# Altium schematic sheet k26_baseboard_telemetry_extconn.SchDoc: k26 Baseboard Telemetry/Ext. Connectors
size A3; DrawnBy: Ch. Vogt; Organization: PBL; DocumentNumber: 1; Revision: r5; SheetNumber: 6
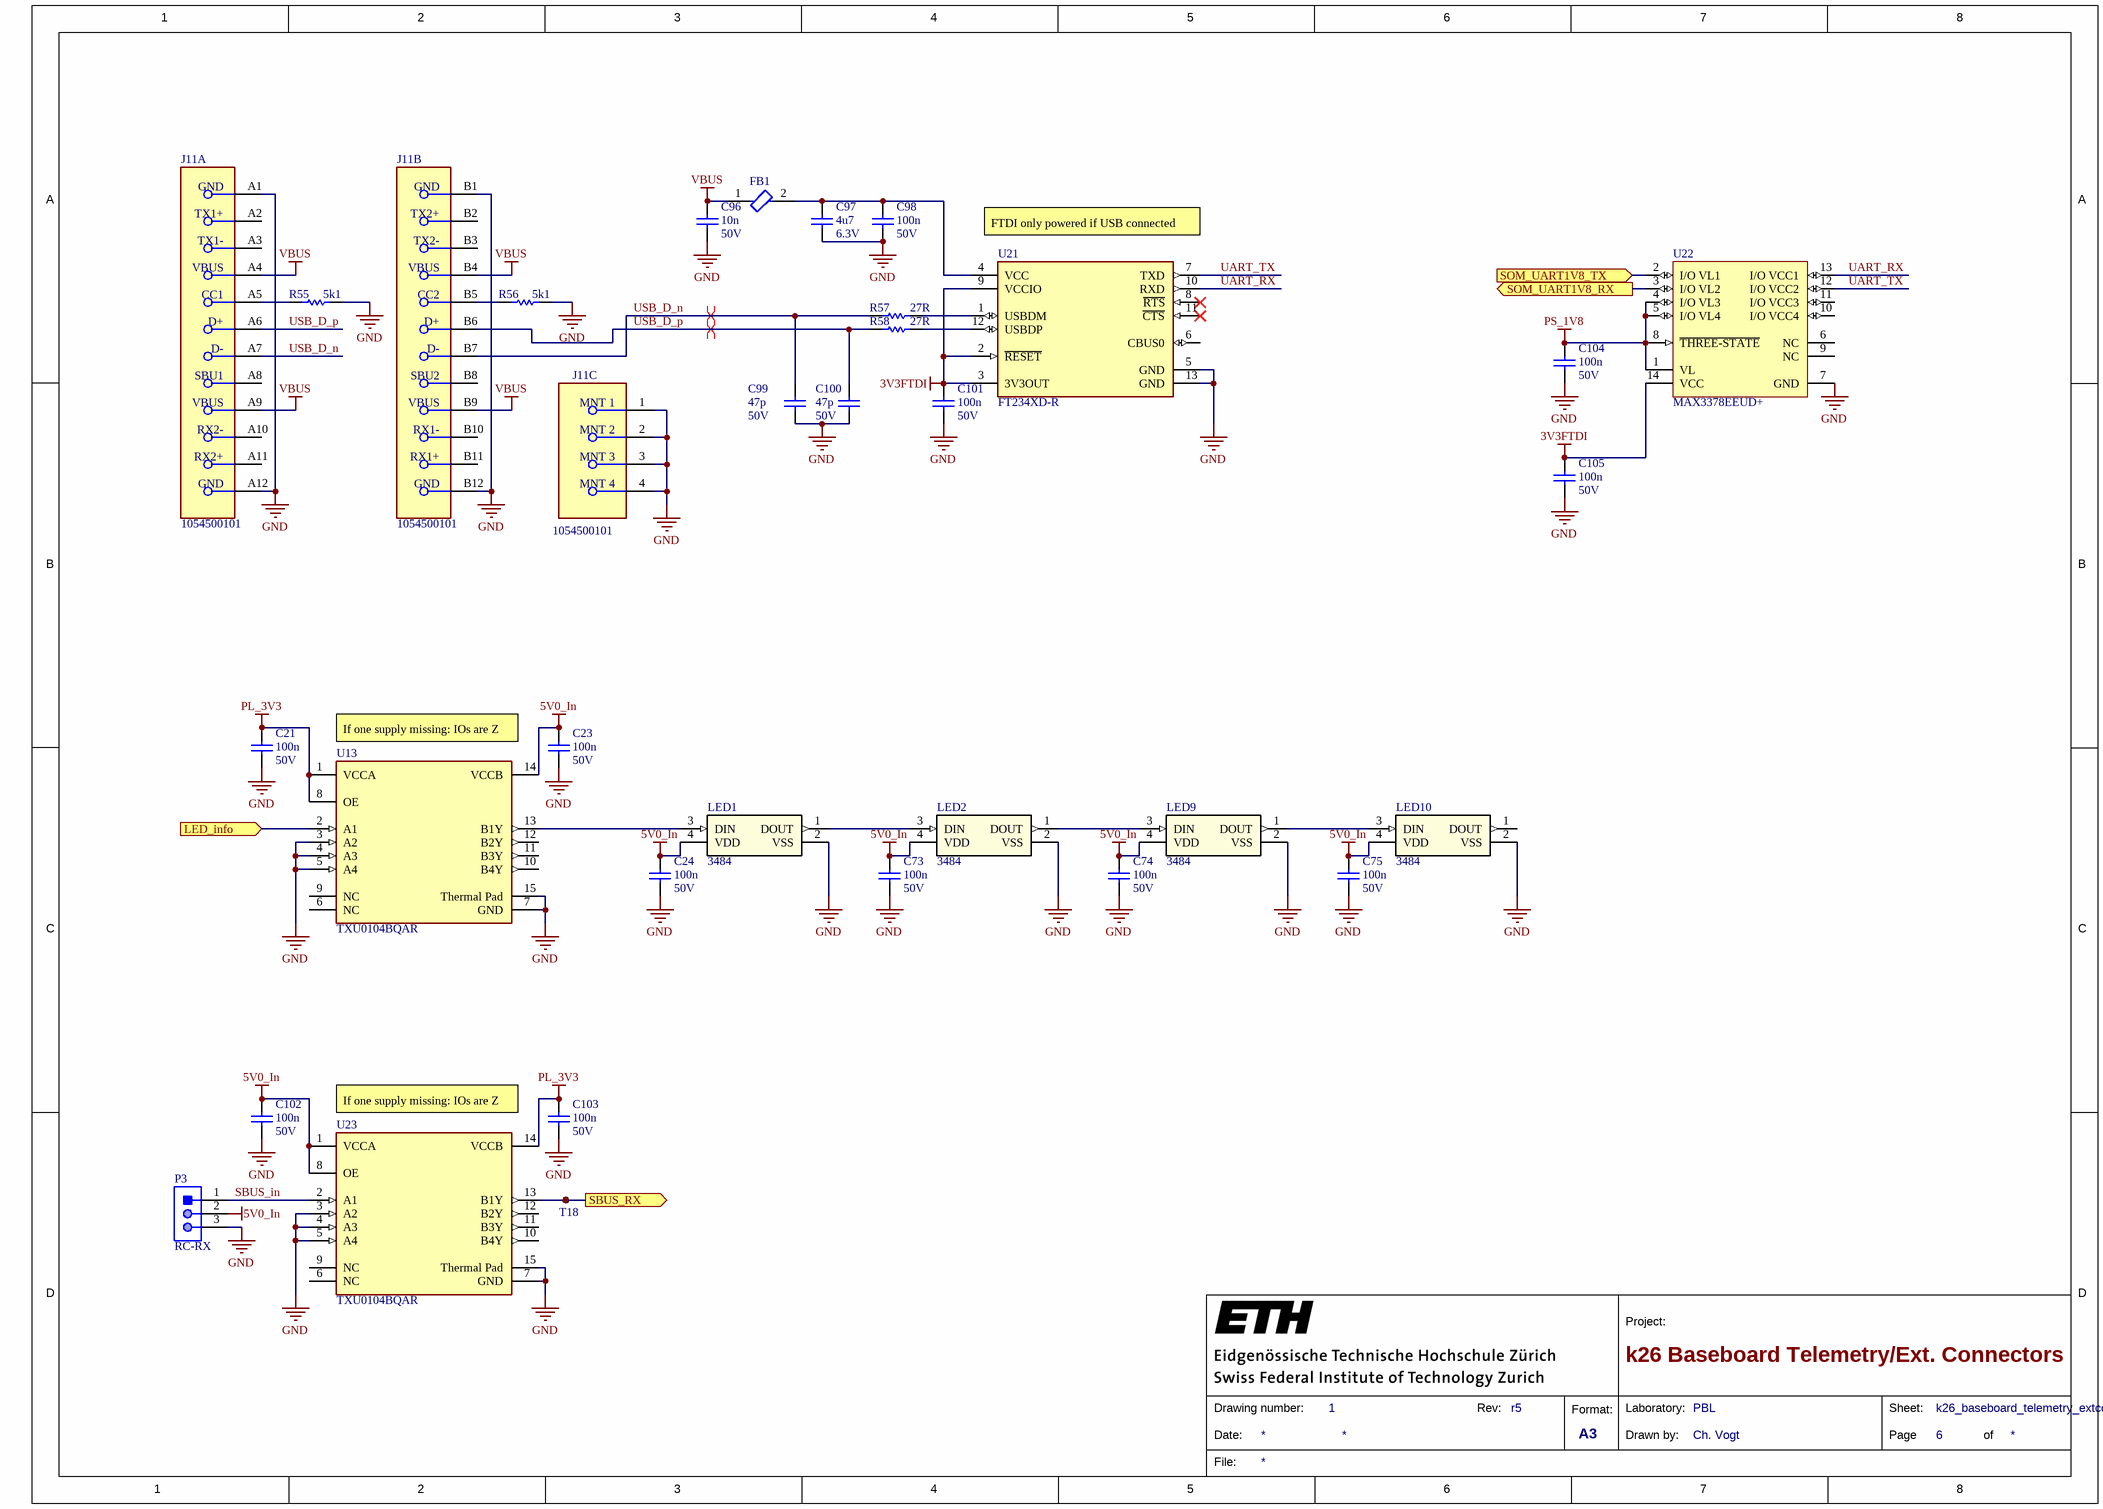
[diagram p0: k26_baseboard_telemetry_extconn.SchDoc]

## Parts
C21  100n  Rated DC Voltage (URdc): 50V  [CAPC0402]
C23  100n  Rated DC Voltage (URdc): 50V  [CAPC0402]
C24  100n  Rated DC Voltage (URdc): 50V  [CAPC0402]
C73  100n  Rated DC Voltage (URdc): 50V  [CAPC0402]
C74  100n  Rated DC Voltage (URdc): 50V  [CAPC0402]
C75  100n  Rated DC Voltage (URdc): 50V  [CAPC0402]
C96  10n  Rated DC Voltage (URdc): 50V  [CAPC0402]
C97  4u7  Rated DC Voltage (URdc): 6.3V  [CAPC0402]
C98  100n  Rated DC Voltage (URdc): 50V  [CAPC0402]
C99  47p  Rated DC Voltage (URdc): 50V  [CAPC0402]
C100  47p  Rated DC Voltage (URdc): 50V  [CAPC0402]
C101  100n  Rated DC Voltage (URdc): 50V  [CAPC0402]
C102  100n  Rated DC Voltage (URdc): 50V  [CAPC0402]
C103  100n  Rated DC Voltage (URdc): 50V  [CAPC0402]
C104  100n  Rated DC Voltage (URdc): 50V  [CAPC0402]
C105  100n  Rated DC Voltage (URdc): 50V  [CAPC0402]
FB1  BLM18PG600SN1D  [FP-BLM18-0_15-t0_8-MFG]  (value not drawn)
J11  1054500101  [FP-1054500101-MFG]  (parts A,B,C of 3)
LED1  3484  [3484_ADA-L]
LED2  3484  [3484_ADA-L]
LED9  3484  [3484_ADA-L]
LED10  3484  [3484_ADA-L]
P3  RC-RX  [MOLX-22-28-4033_V]
R55  5k1  [RES0402]
R56  5k1  [RES0402]
R57  27R  [RES0402]
R58  27R  [RES0402]
T18  CMP-01283-1  [Pad-1mm]  (value not drawn)  (no BOM)
U13  TXU0104BQAR  [FP-BQA0014A-MFG]
U21  FT234XD-R  [FP-DFN-12-IPC_B]
U22  MAX3378EEUD+  [MAXM-U14+1_V]
U23  TXU0104BQAR  [FP-BQA0014A-MFG]

## Ports
LED_info (in), SBUS_RX (out), SOM_UART1V8_RX (out), SOM_UART1V8_TX (in)

## Nets
3V3FTDI: C101.2 C105.2 U21.2(~{RESET}) U21.3(3V3OUT) U21.9(VCCIO) U22.14(VCC)
5V0_In: C23.2 C24.2 C73.2 C74.2 C75.2 C102.2 LED1.4(VDD) LED2.4(VDD) LED9.4(VDD) LED10.4(VDD) P3.2 U13.14(VCCB) U23.1(VCCA) U23.8(OE)
GND: C21.1 C23.1 C24.1 C73.1 C74.1 C75.1 C96.1 C97.1 C98.1 C99.1 C100.1 C101.1 C102.1 C103.1 C104.1 C105.1 J11.1(MNT_1) J11.2(MNT_2) J11.3(MNT_3) J11.4(MNT_4) J11.A1(GND) J11.A12(GND) J11.B1(GND) J11.B12(GND) LED1.2(VSS) LED2.2(VSS) LED9.2(VSS) LED10.2(VSS) P3.3 R55.1 R56.1 U13.3(A2) U13.4(A3) U13.5(A4) U13.7(GND) U13.15(Thermal_Pad) U21.5(GND) U21.13(GND) U22.7(GND) U23.3(A2) U23.4(A3) U23.5(A4) U23.7(GND) U23.15(Thermal_Pad)
PL_3V3: C21.2 C103.2 U13.1(VCCA) U13.8(OE) U23.14(VCCB)
PS_1V8: C104.2 U22.1(VL) U22.4(I/O_VL3) U22.5(I/O_VL4) U22.8(~{THREE-STATE})
VBUS: C96.2 FB1.1 J11.A4(VBUS) J11.A9(VBUS) J11.B4(VBUS) J11.B9(VBUS)
LED_info: U13.2(A1) ; port LED_info
SBUS_in: P3.1 U23.2(A1)
SBUS_RX: T18.1 U23.13(B1Y) ; port SBUS_RX
SOM_UART1V8_RX: U22.3(I/O_VL2) ; port SOM_UART1V8_RX
SOM_UART1V8_TX: U22.2(I/O_VL1) ; port SOM_UART1V8_TX
UART_RX: U21.10(RXD) U22.13(I/O_VCC1)
UART_TX: U21.7(TXD) U22.12(I/O_VCC2)
USB_D_n: C99.2 J11.A7(D-) J11.B7(D-) R57.1
USB_D_p: C100.2 J11.A6(D+) J11.B6(D+) R58.1
NetC97_2: C97.2 C98.2 FB1.2 U21.4(VCC)
NetJ11_A5: J11.A5(CC1) R55.2
NetJ11_B5: J11.B5(CC2) R56.2
NetLED1_1: LED1.1(DOUT) LED2.3(DIN)
NetLED1_3: LED1.3(DIN) U13.13(B1Y)
NetLED2_1: LED2.1(DOUT) LED9.3(DIN)
NetLED9_1: LED9.1(DOUT) LED10.3(DIN)
NetR57_2: R57.2 U21.1(USBDM)
NetR58_2: R58.2 U21.12(USBDP)

Not connected (* = marked no-connect by the designer): J11 A2(TX1+) A3(TX1-) A8(SBU1) A10(RX2-) A11(RX2+) B2(TX2+) B3(TX2-) B8(SBU2) B10(RX1-) B11(RX1+); LED10 1(DOUT); U13 6(NC) 9(NC) 10(B4Y) 11(B3Y) 12(B2Y); U21 6(CBUS0) 8(~{RTS})* 11(~{CTS})*; U22 6(NC) 9(NC) 10(I/O_VCC4) 11(I/O_VCC3); U23 6(NC) 9(NC) 10(B4Y) 11(B3Y) 12(B2Y)

## Layout directives
differential pair: USB_D_n, USB_D_p

## Notes on the sheet
- (near U21) FTDI only powered if USB connected
- If one supply missing: IOs are Z
- 1
- 2
- 3
- 4
- 5
- 6
- 7
- 8
- A
- B
- C
- D
- Project:
- Date:
- Drawing number:
- Rev:
- Format:
- A3
- Drawn by:
- Laboratory:
- Page
- Sheet:
- of
- File:

## Library data of the parts
C21 C23 C24 C73-C75 C98 C101-C105 = cap0402: Ceramic Capacitor, Multilayer, Ceramic, 50V, 10% +Tol, 10% -Tol, X5R, 15% TC, 0.1uF, Surface Mount, 0402; Manufacturer: Yageo; Manufacturer Part Number: CC0402KRX5R9BB104; Capacitance: 100nF; Multilayer: Yes; Supplier 1: Farnell; Supplier Part Number 1: 3366442; RoHS: Yes; Category: Ceramic Capacitors; Stock 1: 180000; Pricing 1: 10000=0.00890, 50000=0.00870 (CHF); Mount: Surface Mount; Number of Pins: 2; Dielectric Material: Ceramic; Package Shape: Rectangular; Size Code: 0402; Terminal Finish: Nickel; Min Operating Temperature: -55°C; Max Operating Temperature: 85°C; JESD-609 Code: e3; Capacitor Type: Ceramic; Negative Tolerance: 10%; Temperature Characteristics Code: X5R; Termination: Wraparound; Positive Tolerance: 10%; Package Style: SMTMeter; Packaging: Tape and Reel; Length: 1mm; Width: 0.5mm; Height: 0.5mm; Reach SVHC Compliant: Yes; RoHS Compliant: Yes; ComponentLink1URL: https://datasheet.ciiva.com:443/pdfs/VipMasterIC/IC/YAGO/YAGO-S-A0006851646/YAGO-S-A0006851646-1.pdf?src-supplier=IHS+Markit; ComponentLink1Description: https://datasheet.ciiva.com:443/pdfs/VipMasterIC/IC/YAGO/YAGO-S-A0006851646/YAGO-S-A0006851646-1.pdf?src-supplier=IHS+Markit; ComponentLink2URL: http://www.yageo.com/documents/recent/UPY-GPHC_X5R_4V-to-50V_25.pdf?src-supplier=Digi-Key; ComponentLink2Description: http://www.yageo.com/documents/recent/UPY-GPHC_X5R_4V-to-50V_25.pdf?src-supplier=Digi-Key; ComponentLink3URL: http://www.yageo.com/documents/recent/UPY-GPHC_X5R_4V-to-50V_23.pdf?src-supplier=Digi-Key; ComponentLink3Description: http://www.yageo.com/documents/recent/UPY-GPHC_X5R_4V-to-50V_23.pdf?src-supplier=Digi-Key
C96 = cap0402: Ceramic Capacitor, Multilayer, Ceramic, 50V, 10% +Tol, 10% -Tol, X7R, 15% TC, 0.01uF, Surface Mount, 0402; Manufacturer: Samsung; Manufacturer Part Number: CL05B103KB5NNNC; Value: 10nF; Multilayer: Yes; Supplier: Rs; Supplier Part Number: 7661558; RoHS: Yes; Category: Ceramic Capacitors; Stock: 350000; Pricing: 10000=0.00500, 30000=0.00400, 50000=0.00400, 100000=0.00400, 250000=0.00400 (CHF); Mounting Technology: Surface Mount; Pins: 2; Dielectric Material: Ceramic; Case/Package: 0402; Package Shape: Rectangular; Terminal Finish: Nickel; Min Operating Temperature: -55°C; Max Operating Temperature: 125°C; Capacitor Type: Ceramic; Tolerance  (fill in as +-): 10%; Tolerance (fill in as +-): 10%; Temperature Characteristics Code: X7R; Package Style: SMTMeter; Packaging: Tape and Reel; Termination: Wraparound; JESD-609 Code: e3; Length: 1mm; Width: 0.5mm; Height: 0.55mm; RoHS Compliant: Yes; Reach SVHC Compliant: Yes; ComponentLink1URL: https://datasheet.ciiva.com:443/pdfs/VipMasterIC/IC/SEMS/SEMS-S-A0008525088/SEMS-S-A0008525146-1.pdf?src-supplier=IHS+Markit; ComponentLink1Description: https://datasheet.ciiva.com:443/pdfs/VipMasterIC/IC/SEMS/SEMS-S-A0008525088/SEMS-S-A0008525146-1.pdf?src-supplier=IHS+Markit; ComponentLink2URL: https://datasheet.ciiva.com/15195/getdatasheetpartid-359682-15195636.pdf?src-supplier=Verical; ComponentLink2Description: https://datasheet.ciiva.com/15195/getdatasheetpartid-359682-15195636.pdf?src-supplier=Verical; ComponentLink3URL: https://datasheet.ciiva.com/29198/458761-da-01-en-vs-kondensator-0402-29198432.pdf?src-supplier=Conrad; ComponentLink3Description: https://datasheet.ciiva.com/29198/458761-da-01-en-vs-kondensator-0402-29198432.pdf?src-supplier=Conrad; ComponentLink4URL: https://datasheet.ciiva.com/26309/mlcc-catalogdownload2013-eng-26309005.pdf?src-supplier=Distrelec; ComponentLink4Description: https://datasheet.ciiva.com/26309/mlcc-catalogdownload2013-eng-26309005.pdf?src-supplier=Distrelec
C97 = cap0402: Ceramic Capacitor, Multilayer, Ceramic, 6.3V, 20% +Tol, 20% -Tol, X5R, 15% TC, 4.7uF, Surface Mount, 0402; Manufacturer: Murata; Manufacturer Part Number: GRM155R60J475ME47D; Multilayer: Yes; Supplier: Rs; Supplier Part Number: 8145230P; RoHS: Yes; Category: Ceramic Capacitors; Stock: 151550; Pricing: 250=0.08100, 500=0.07500, 1000=0.07000, 2500=0.06200 (CHF); Mounting Technology: Surface Mount; Pins: 2; Dielectric Material: Ceramic; Package Shape: Rectangular; Case/Package: 0402; Terminal Finish: Nickel; Min Operating Temperature: -55°C; Max Operating Temperature: 85°C; Value: 4.7uF; Capacitor Type: Ceramic; Tolerance  (fill in as +-): 20%; Packaging: Tape and Reel; Tolerance (fill in as +-): 20%; Termination: Wraparound; JESD-609 Code: e3; Temperature Characteristics Code: X5R; Package Style: SMTMeter; Length: 1mm; Width: 0.5mm; Height: 0.5mm; Reach SVHC Compliant: Yes; RoHS Compliant: Yes; ComponentLink1URL: https://datasheet.ciiva.com:443/pdfs/VipMasterIC/IC/MURE/MURE-S-A0008911298/MURE-S-A0008911388-1.pdf?src-supplier=IHS+Markit; ComponentLink1Description: https://datasheet.ciiva.com:443/pdfs/VipMasterIC/IC/MURE/MURE-S-A0008911298/MURE-S-A0008911388-1.pdf?src-supplier=IHS+Markit; ComponentLink2URL: https://datasheet.ciiva.com/6270/product-6270483.pdf?src-supplier=Digi-Key; ComponentLink2Description: https://datasheet.ciiva.com/6270/product-6270483.pdf?src-supplier=Digi-Key; ComponentLink3URL: https://datasheet.ciiva.com/46418/1769893-46418044.pdf?src-supplier=Element14; ComponentLink3Description: https://datasheet.ciiva.com/46418/1769893-46418044.pdf?src-supplier=Element14; ComponentLink4URL: https://datasheet.ciiva.com/46418/1769893-46418045.pdf?src-supplier=Element14; ComponentLink4Description: https://datasheet.ciiva.com/46418/1769893-46418045.pdf?src-supplier=Element14; ComponentLink5URL: https://datasheet.ciiva.com/6268/partnumbering-e-01-6268378.pdf?src-supplier=Digi-Key; ComponentLink5Description: https://datasheet.ciiva.com/6268/partnumbering-e-01-6268378.pdf?src-supplier=Digi-Key; ComponentLink6URL: https://datasheet.ciiva.com/6268/partnumbering-e-01-6268382.pdf?src-supplier=Digi-Key; ComponentLink6Description: https://datasheet.ciiva.com/6268/partnumbering-e-01-6268382.pdf?src-supplier=Digi-Key
C99 C100 = cap0402: Ceramic Capacitor, Multilayer, Ceramic, 50V, 5% +Tol, 5% -Tol, C0G, -/+30ppm/Cel TC, 0.000047uF, Surface Mount, 0402; Manufacturer: Murata; Manufacturer Part Number: GRM1555C1H470JZ01D; Value: 47pF; Multilayer: Yes; Supplier: Farnell; Supplier Part Number: 1118143; RoHS: Yes; Category: Ceramic Capacitors; Pricing: 1=41.51000, 3=38.54000 (GBP); Mounting Technology: Surface Mount; Pins: 2; Dielectric Material: Ceramic; Case/Package: 0402; Terminal Finish: Nickel; Package Shape: Rectangular; Min Operating Temperature: -55°C; Max Operating Temperature: 125°C; JESD-609 Code: e3; Capacitor Type: Ceramic; Tolerance  (fill in as +-): 5%; Package Style: SMTMeter; Packaging: Tape and Reel; Tolerance (fill in as +-): 5%; Temperature Characteristics Code: C0G; Termination: Wraparound; Length: 1mm; Width: 0.5mm; Height: 0.5mm; RoHS Compliant: Yes; Reach SVHC Compliant: Yes
  C99: ComponentLink1URL: https://datasheet.ciiva.com:443/pdfs/VipMasterIC/IC/MURE/MURE-S-A0002988077/MURE-S-A0002987565-1.pdf?src-supplier=IHS+Markit; ComponentLink1Description: https://datasheet.ciiva.com:443/pdfs/VipMasterIC/IC/MURE/MURE-S-A0002988077/MURE-S-A0002987565-1.pdf?src-supplier=IHS+Markit; ComponentLink2URL: https://datasheet.ciiva.com/129/product-129747.pdf?src-supplier=Digi-Key; ComponentLink2Description: https://datasheet.ciiva.com/129/product-129747.pdf?src-supplier=Digi-Key; ComponentLink3URL: https://datasheet.ciiva.com/18100/getdatasheetpartid-32342-18100875.pdf?src-supplier=Verical; ComponentLink3Description: https://datasheet.ciiva.com/18100/getdatasheetpartid-32342-18100875.pdf?src-supplier=Verical; ComponentLink4URL: https://datasheet.ciiva.com/11787/0900766b807a1cab-11787251.pdf?src-supplier=Rs; ComponentLink4Description: https://datasheet.ciiva.com/11787/0900766b807a1cab-11787251.pdf?src-supplier=Rs; ComponentLink5URL: https://datasheet.ciiva.com/129/partnumbering-e-01-129748.pdf?src-supplier=Digi-Key; ComponentLink5Description: https://datasheet.ciiva.com/129/partnumbering-e-01-129748.pdf?src-supplier=Digi-Key; ComponentLink6URL: https://datasheet.ciiva.com/129/partnumbering-e-01-129749.pdf?src-supplier=Digi-Key; ComponentLink6Description: https://datasheet.ciiva.com/129/partnumbering-e-01-129749.pdf?src-supplier=Digi-Key; ComponentLink7URL: https://datasheet.ciiva.com/16396/l0005e-16396809.pdf?src-supplier=Future+Electronics; ComponentLink7Description: https://datasheet.ciiva.com/16396/l0005e-16396809.pdf?src-supplier=Future+Electronics
  C100: ComponentLink1URL: https://datasheet.ciiva.com:443/pdfs/VipMasterIC/IC/YAGO/YAGO-S-A0006851646/YAGO-S-A0006851646-1.pdf?src-supplier=IHS+Markit; ComponentLink1Description: https://datasheet.ciiva.com:443/pdfs/VipMasterIC/IC/YAGO/YAGO-S-A0006851646/YAGO-S-A0006851646-1.pdf?src-supplier=IHS+Markit; ComponentLink2URL: http://www.yageo.com/documents/recent/UPY-GPHC_X5R_4V-to-50V_25.pdf?src-supplier=Digi-Key; ComponentLink2Description: http://www.yageo.com/documents/recent/UPY-GPHC_X5R_4V-to-50V_25.pdf?src-supplier=Digi-Key; ComponentLink3URL: http://www.yageo.com/documents/recent/UPY-GPHC_X5R_4V-to-50V_23.pdf?src-supplier=Digi-Key; ComponentLink3Description: http://www.yageo.com/documents/recent/UPY-GPHC_X5R_4V-to-50V_23.pdf?src-supplier=Digi-Key; ComponentLink4URL: https://datasheet.ciiva.com:443/pdfs/VipMasterIC/IC/MURE/MURE-S-A0002988077/MURE-S-A0002987565-1.pdf?src-supplier=IHS+Markit; ComponentLink4Description: https://datasheet.ciiva.com:443/pdfs/VipMasterIC/IC/MURE/MURE-S-A0002988077/MURE-S-A0002987565-1.pdf?src-supplier=IHS+Markit; ComponentLink5URL: https://datasheet.ciiva.com/129/product-129747.pdf?src-supplier=Digi-Key; ComponentLink5Description: https://datasheet.ciiva.com/129/product-129747.pdf?src-supplier=Digi-Key; ComponentLink6URL: https://datasheet.ciiva.com/18100/getdatasheetpartid-32342-18100875.pdf?src-supplier=Verical; ComponentLink6Description: https://datasheet.ciiva.com/18100/getdatasheetpartid-32342-18100875.pdf?src-supplier=Verical; ComponentLink7URL: https://datasheet.ciiva.com/11787/0900766b807a1cab-11787251.pdf?src-supplier=Rs; ComponentLink7Description: https://datasheet.ciiva.com/11787/0900766b807a1cab-11787251.pdf?src-supplier=Rs; ComponentLink8URL: https://datasheet.ciiva.com/129/partnumbering-e-01-129748.pdf?src-supplier=Digi-Key; ComponentLink8Description: https://datasheet.ciiva.com/129/partnumbering-e-01-129748.pdf?src-supplier=Digi-Key; ComponentLink9URL: https://datasheet.ciiva.com/129/partnumbering-e-01-129749.pdf?src-supplier=Digi-Key; ComponentLink9Description: https://datasheet.ciiva.com/129/partnumbering-e-01-129749.pdf?src-supplier=Digi-Key; ComponentLink10URL: https://datasheet.ciiva.com/16396/l0005e-16396809.pdf?src-supplier=Future+Electronics; ComponentLink10Description: https://datasheet.ciiva.com/16396/l0005e-16396809.pdf?src-supplier=Future+Electronics
FB1 = CMP-0686-00575-3: Chip Ferrite Bead, 0603, 60Ω @ 100MHz, 0.1Ω, , 1A; Manufacturer: Murata; ESR (Equivalent Series Resistance): 60R; Number of Lines: 1; Material: Steel; Tolerance: 25%; Shielding: Unshielded; Current Rating: 500mA; Resistance: 100mR; Package Quantity: 1; Termination: SMD/SMT; Lead Free: Lead Free; Max Operating Temperature: 125°C; Number of Circuits: 1; Length: 1.6mm; Min Operating Temperature: -55°C; Case Code (Metric): 1608; Max DC Current: 500mA; REACH SVHC: No SVHC; Frequency: 100MHz; Number of Pins: 2; RoHS Compliant: Yes; Height: 0.8mm; Depth: 0.8mm; Width: 0.8mm; Test Frequency: 100MHz; Case/Package: 0603; Impedance: 60R; Max Current Rating: 500mA; Packaging: Tape and Reel; DC Resistance (DCR): 100mR; Case Code (Imperial): 0603; Core Material: Ferrite; Manufacturer Part Number: BLM18PG600SN1D
J11 = CONN RCP USB3.1: CONN RCP USB3.1 TYPEC 24P SMD RA; Manufacturer: Molex; Manufacturer Part Number: 105450-0101; Number Of Contacts: 24; Voltage Rating: 30V; Shielding: true; Is Female: yes; Current Rating: 0.25/1.25/5A; Pitch: 0.5mm; Conn Orientation: Right Angle; Package: 0; Height: 3.44mm; Footprint Url: https://www.molex.com/pdm_docs/sd/1054500101_sd.pdf; Device Class L1: Connectors; Category: Conn; Device Class L2: USB Connectors; Digikey Description: CONN RCP USB3.1 TYPEC 24P SMD RA; Contact Material: Gold,Nickel; Mouser Description: USB Shielded I/O Receptacle; Type C; Right Angle; Surface Mount; Gold over Nickel; ComponentLink2Description: Datasheet; Lead Free: Yes; Automotive: No; Temperature Range High: +85°C; RoHS: TRUE; Octopart: https://octopart.com/105450-0101-molex-68082325; ComponentLink2URL: https://www.molex.com/webdocs/datasheets/pdf/en-us/1054500101_IO_CONNECTORS.pdf; Temperature: -30°C to +85°C; Usb Standard: USB 3.1; Temperature Range Low: -30°C; Device Class L3: unset; Manufacturer Part Number: 1054500101
LED1 LED2 LED9 LED10 = 3484: No Description Available; Mfr_Name: Adafruit Industries; Type: DEV; Copyright: Copyright (C) 2024 Ultra Librarian. All rights reserved.; Manufacturer_Part_Number: 3484; RefDes: RefDes
P3 = CMP-1676-00001-5: Male Header, Pitch 2.54 mm, 1 x 3 Position, Height 8.38 mm, Tail Length 3.18 mm, RoHS, Bulk; Manufacturer: Molex; Rows: 1; Voltage Rating: 250 V; Current Rating: 4 A; Min Operating Temperature: 0 degC; Lead Pitch: 0.1 inch; Packaging: Bulk; Contact Finish: Gold; RoHSCompliant: true; Contact Material: Brass; PackageReference: 22-28-4033; REACH SVHC: Unknown; PackageDescription: Male Header, Pitch 2.54 mm, 1 x 3 Position, Height 8.38 mm, Tail Length 3.18 mm; ComponentLink2URL: http://www.molex.com/pdm_docs/sd/022284033_sd.pdf; Height: 8.38 mm; Mounting Technology: Through Hole; ComponentLink1Description: Manufacturer URL; Length: 7.62 mm; Mount: Through Hole; DatasheetVersion: Rev. G, 01/2012; Max Operating Temperature: 75 degC; ComponentLink2Description: Datasheet; Colour: Black; Pins: 3; Contact Plating: Gold; Package Quantity: 1; ComponentLink1URL: http://www.molex.com/; Manufacturer Part Number: 22-28-4033
R55 R56 = res0402: Fixed Resistor, Metal Glaze/thick Film, 0.0625W, 5100ohm, 50V, 1% +/-Tol, 100ppm/Cel, Surface Mount, 0402; Manufacturer: Yageo; Manufacturer Part Number: RC0402FR-075K1L; Power: 62.5mW; Value: 5.1kR; Temperature Coefficient: 100ppm/°C; Rated Temperature: 70°C; Additional Feature: LASER TRIMMABLE; Package Height: 0.35mm; Package Length: 1mm; Package Width: 0.5mm; Supplier: Rs; Supplier Part Number: 1987836; RoHS: Yes; Category: Chip SMD Resistors; Stock: 16400; Pricing: 100=0.01100, 1000=0.01100, 2500=0.00900, 5000=0.00800, 10000=0.00800 (CHF); Mounting Technology: Surface Mount; Pins: 2; Case/Package: 0402; Package Shape: Rectangular; Terminal Finish: Nickel; Min Operating Temperature: -55°C; Max Operating Temperature: 155°C; Tolerance: 1%; Resistor Type: FIXED RESISTOR; Construction: Chip; Package Style: SMTMeter; Technology: METAL GLAZE/THICK FILM; Termination: Wraparound; Working Voltage: 50V; JESD-609 Code: e3; Packaging: Tape and Reel; Reach SVHC Compliant: Yes; RoHS Compliant: Yes; ComponentLink1URL: https://datasheet.ciiva.com:443/pdfs/VipMasterIC/IC/YAGO/YAGO-S-A0008145938/YAGO-S-A0008145938-1.pdf?src-supplier=IHS+Markit; ComponentLink1Description: https://datasheet.ciiva.com:443/pdfs/VipMasterIC/IC/YAGO/YAGO-S-A0008145938/YAGO-S-A0008145938-1.pdf?src-supplier=IHS+Markit; ComponentLink2URL: https://datasheet.ciiva.com/7983/1018594-7983519.pdf?src-supplier=Element14; ComponentLink2Description: https://datasheet.ciiva.com/7983/1018594-7983519.pdf?src-supplier=Element14; ComponentLink3URL: https://datasheet.ciiva.com/46394/1018594-46394936.pdf?src-supplier=Element14; ComponentLink3Description: https://datasheet.ciiva.com/46394/1018594-46394936.pdf?src-supplier=Element14; ComponentLink4URL: https://datasheet.ciiva.com/2453/pyu-r-int-thick-7-2453401.pdf?src-supplier=Digi-Key; ComponentLink4Description: https://datasheet.ciiva.com/2453/pyu-r-int-thick-7-2453401.pdf?src-supplier=Digi-Key; ComponentLink5URL: https://datasheet.ciiva.com/2453/pyu-r-int-thick-7-2453402.pdf?src-supplier=Digi-Key; ComponentLink5Description: https://datasheet.ciiva.com/2453/pyu-r-int-thick-7-2453402.pdf?src-supplier=Digi-Key; ComponentLink6URL: https://datasheet.ciiva.com/2453/pyu-r-int-thick-7-2453400.pdf?src-supplier=Digi-Key; ComponentLink6Description: https://datasheet.ciiva.com/2453/pyu-r-int-thick-7-2453400.pdf?src-supplier=Digi-Key; ComponentLink7URL: https://datasheet.ciiva.com/12558/pyu-rc0402-51-rohs-l-6-r-8721-12558460.pdf?src-supplier=Mouser; ComponentLink7Description: https://datasheet.ciiva.com/12558/pyu-rc0402-51-rohs-l-6-r-8721-12558460.pdf?src-supplier=Mouser; ComponentLink8URL: https://datasheet.ciiva.com/16744/pyu-rc0402-51-rohs-l-6-r-16744283.pdf?src-supplier=Future+Electronics; ComponentLink8Description: https://datasheet.ciiva.com/16744/pyu-rc0402-51-rohs-l-6-r-16744283.pdf?src-supplier=Future+Electronics; ComponentLink9URL: https://datasheet.ciiva.com/15189/getdatasheetpartid-323636-15189493.pdf?src-supplier=Verical; ComponentLink9Description: https://datasheet.ciiva.com/15189/getdatasheetpartid-323636-15189493.pdf?src-supplier=Verical
R57 R58 = res0402: Fixed Resistor, Metal Glaze/thick Film, 0.1W, 27ohm, 50V, 1% +/-Tol, 100ppm/Cel, Surface Mount, 0402; Manufacturer: Panasonic; Manufacturer Part Number: ERJ-2RKF27R0X; Power: 100mW; Rated Temperature: 70°C; Temperature Coefficient: 100ppm/°C; Package Height: 0.35mm; Package Length: 1mm; Package Width: 0.5mm; Reference Standard: AEC-Q200; Supplier: Farnell; Supplier Part Number: 2397008; RoHS: Yes; Category: Chip SMD Resistors; Stock: 270000; Pricing: 10000=0.00490, 50000=0.00480, 100000=0.00470 (CHF); Mounting Technology: Surface Mount; Pins: 2; Case/Package: 0402; Package Shape: Rectangular; Terminal Finish: Nickel; Min Operating Temperature: -55°C; Max Operating Temperature: 155°C; Tolerance: 1%; Resistor Type: FIXED RESISTOR; Packaging: Tape and Reel; Value: 27R; Termination: Wraparound; Working Voltage: 50V; Construction: Rectangular; Package Style: SMTMeter; Technology: METAL GLAZE/THICK FILM; JESD-609 Code: e3; RoHS Compliant: Yes; Reach SVHC Compliant: Yes; ComponentLink1URL: https://datasheet.ciiva.com:443/pdfs/VipMasterIC/IC/PANA/PANA-S-A0009889626/PANA-S-A0009889626-1.pdf?src-supplier=IHS+Markit; ComponentLink1Description: https://datasheet.ciiva.com:443/pdfs/VipMasterIC/IC/PANA/PANA-S-A0009889626/PANA-S-A0009889626-1.pdf?src-supplier=IHS+Markit
  R57: ComponentLink2URL: https://datasheet.ciiva.com/11821/0900766b80f80784-11821276.pdf?src-supplier=Rs; ComponentLink2Description: https://datasheet.ciiva.com/11821/0900766b80f80784-11821276.pdf?src-supplier=Rs; ComponentLink3URL: https://datasheet.ciiva.com/7891/aoa0000ce2-7891306.pdf?src-supplier=Element14; ComponentLink3Description: https://datasheet.ciiva.com/7891/aoa0000ce2-7891306.pdf?src-supplier=Element14; ComponentLink4URL: https://datasheet.ciiva.com/7891/426256-7891578.pdf?src-supplier=Element14; ComponentLink4Description: https://datasheet.ciiva.com/7891/426256-7891578.pdf?src-supplier=Element14; ComponentLink5URL: https://datasheet.ciiva.com/43467/1678782-43467165.pdf?src-supplier=Farnell; ComponentLink5Description: https://datasheet.ciiva.com/43467/1678782-43467165.pdf?src-supplier=Farnell; ComponentLink6URL: https://datasheet.ciiva.com/46373/1678782-46373579.pdf?src-supplier=Element14; ComponentLink6Description: https://datasheet.ciiva.com/46373/1678782-46373579.pdf?src-supplier=Element14; ComponentLink7URL: https://datasheet.ciiva.com/22681/1678782-22681159.pdf?src-supplier=Element14; ComponentLink7Description: https://datasheet.ciiva.com/22681/1678782-22681159.pdf?src-supplier=Element14; ComponentLink8URL: https://datasheet.ciiva.com/46373/1678782-46373578.pdf?src-supplier=Element14; ComponentLink8Description: https://datasheet.ciiva.com/46373/1678782-46373578.pdf?src-supplier=Element14; ComponentLink9URL: https://datasheet.ciiva.com/9191/aoa0000ce2-9191129.pdf?src-supplier=Avnet; ComponentLink9Description: https://datasheet.ciiva.com/9191/aoa0000ce2-9191129.pdf?src-supplier=Avnet; ComponentLink10URL: https://datasheet.ciiva.com/9191/aoa0000ce2-9191130.pdf?src-supplier=Avnet; ComponentLink10Description: https://datasheet.ciiva.com/9191/aoa0000ce2-9191130.pdf?src-supplier=Avnet
  R58: ComponentLink2URL: https://datasheet.ciiva.com/6201/426256-6201373.pdf?src-supplier=Farnell; ComponentLink2Description: https://datasheet.ciiva.com/6201/426256-6201373.pdf?src-supplier=Farnell; ComponentLink3URL: https://datasheet.ciiva.com/46377/426256-46377550.pdf?src-supplier=Element14; ComponentLink3Description: https://datasheet.ciiva.com/46377/426256-46377550.pdf?src-supplier=Element14; ComponentLink4URL: https://datasheet.ciiva.com/22749/1678782-22749610.pdf?src-supplier=Element14; ComponentLink4Description: https://datasheet.ciiva.com/22749/1678782-22749610.pdf?src-supplier=Element14; ComponentLink5URL: https://datasheet.ciiva.com/28695/1678782-28695781.pdf?src-supplier=Element14; ComponentLink5Description: https://datasheet.ciiva.com/28695/1678782-28695781.pdf?src-supplier=Element14; ComponentLink6URL: https://datasheet.ciiva.com/16766/70260748-16766015.pdf?src-supplier=Allied+Electronics; ComponentLink6Description: https://datasheet.ciiva.com/16766/70260748-16766015.pdf?src-supplier=Allied+Electronics; ComponentLink7URL: https://datasheet.ciiva.com/16765/70260748-16765054.pdf?src-supplier=Allied+Electronics; ComponentLink7Description: https://datasheet.ciiva.com/16765/70260748-16765054.pdf?src-supplier=Allied+Electronics; ComponentLink8URL: https://datasheet.ciiva.com/9181/aoa0000ce2-9181461.pdf?src-supplier=Avnet; ComponentLink8Description: https://datasheet.ciiva.com/9181/aoa0000ce2-9181461.pdf?src-supplier=Avnet; ComponentLink9URL: https://datasheet.ciiva.com/16508/aoa0000ce2-16508382.pdf?src-supplier=Future+Electronics; ComponentLink9Description: https://datasheet.ciiva.com/16508/aoa0000ce2-16508382.pdf?src-supplier=Future+Electronics; ComponentLink10URL: https://datasheet.ciiva.com/11821/0900766b80f80784-11821276.pdf?src-supplier=Rs; ComponentLink10Description: https://datasheet.ciiva.com/11821/0900766b80f80784-11821276.pdf?src-supplier=Rs; ComponentLink11URL: https://datasheet.ciiva.com/7891/aoa0000ce2-7891306.pdf?src-supplier=Element14; ComponentLink11Description: https://datasheet.ciiva.com/7891/aoa0000ce2-7891306.pdf?src-supplier=Element14; ComponentLink12URL: https://datasheet.ciiva.com/7891/426256-7891578.pdf?src-supplier=Element14; ComponentLink12Description: https://datasheet.ciiva.com/7891/426256-7891578.pdf?src-supplier=Element14; ComponentLink13URL: https://datasheet.ciiva.com/43467/1678782-43467165.pdf?src-supplier=Farnell; ComponentLink13Description: https://datasheet.ciiva.com/43467/1678782-43467165.pdf?src-supplier=Farnell; ComponentLink14URL: https://datasheet.ciiva.com/46373/1678782-46373579.pdf?src-supplier=Element14; ComponentLink14Description: https://datasheet.ciiva.com/46373/1678782-46373579.pdf?src-supplier=Element14; ComponentLink15URL: https://datasheet.ciiva.com/22681/1678782-22681159.pdf?src-supplier=Element14; ComponentLink15Description: https://datasheet.ciiva.com/22681/1678782-22681159.pdf?src-supplier=Element14; ComponentLink16URL: https://datasheet.ciiva.com/46373/1678782-46373578.pdf?src-supplier=Element14; ComponentLink16Description: https://datasheet.ciiva.com/46373/1678782-46373578.pdf?src-supplier=Element14; ComponentLink17URL: https://datasheet.ciiva.com/9191/aoa0000ce2-9191129.pdf?src-supplier=Avnet; ComponentLink17Description: https://datasheet.ciiva.com/9191/aoa0000ce2-9191129.pdf?src-supplier=Avnet; ComponentLink18URL: https://datasheet.ciiva.com/9191/aoa0000ce2-9191130.pdf?src-supplier=Avnet; ComponentLink18Description: https://datasheet.ciiva.com/9191/aoa0000ce2-9191130.pdf?src-supplier=Avnet
T18 = CMP-01283-1: 1mm SMT Test Pad; Mounting Technology: SMT
U13 U23 = CMP-04899-000128-1: FOUR CHANNEL UNIDIRECTIONAL LEVE; Manufacturer: Texas Instruments; Manufacturer Part Number: TXU0104BQAR
U21 = CMP-0248-00027-3: IC USB SERIAL BASIC UART 12DFN; Manufacturer: FTDI; Min Supply Voltage: 2.97V; Number of Ports: 1; Operating Supply Voltage: 5V; Operating Supply Current: 8mA; Max Supply Voltage: 5.5V; Data Rate: 3Mbps; Length: 3mm; Case/Package: DFN; Mount: Surface Mount; Packaging: Tape and Reel; Max Operating Temperature: 85°C; Height: 0.75mm; Number of Pins: 12; Number of Transceivers: 1; Package Quantity: 5000; Min Operating Temperature: -40°C; Width: 3mm; REACH SVHC: No SVHC; Interface: UART; Lead Free: Lead Free; Manufacturer Part Number: FT234XD-R
U22 = CMP-1703-00001-3: +/-15 kV ESD-Protected, 1 uA, 8 Mbps, Quad Low-Voltage Level Translator in UCSP, 1.65 to 5.5 V, -40 to 85 degC, 14-Pin TSSOP (U14+1), RoHS, Tube; Manufacturer: Maxim; Channels: 4; Min Supply Voltage: 1.65 V; Max Supply Voltage: 5.5 V; Max Ouput Current: -20 uA; Output Current: 1 mA; Case/Package: TSSOP; DatasheetVersion: Rev. 3; Inputs: 4; Max Operating Temperature: 85 degC; ComponentLink3URL: http://pdfserv.maximintegrated.com/package_dwgs/21-0066.PDF; Mount: Surface Mount; Weight: 0.004949 oz; Code_JEDEC: MO-153; ComponentLink3Description: Package Specification; Packaging: Rail/Tube; Pins: 14; REACH SVHC: No SVHC; Package Quantity: 96; PartNumber: MAX3378EEUD+; Width: 4.5 mm; ComponentLink1Description: Manufacturer URL; Height: 0.95 mm; ComponentLink2URL: https://datasheets.maximintegrated.com/en/ds/MAX3372E-MAX3393E.pdf; Radiation Hardening: No; Length: 5.1 mm; PackageDescription: 14-Pin Thin Shrink Small-Outline Package (U14+1), Body 5 x 4.4 mm, Pitch 0.65 mm; RoHSCompliant: True; Min Operating Temperature: -40 degC; Mounting Technology: Surface Mount; ComponentLink2Description: Datasheet; ComponentLink1URL: http://www.maximintegrated.com/; Manufacturer Part Number: MAX3378EEUD+